# Altium schematic sheet IMX8_LPDDR4.SchDoc
size 594 x 420 mm; SheetNumber: 8; SheetTotal: 20
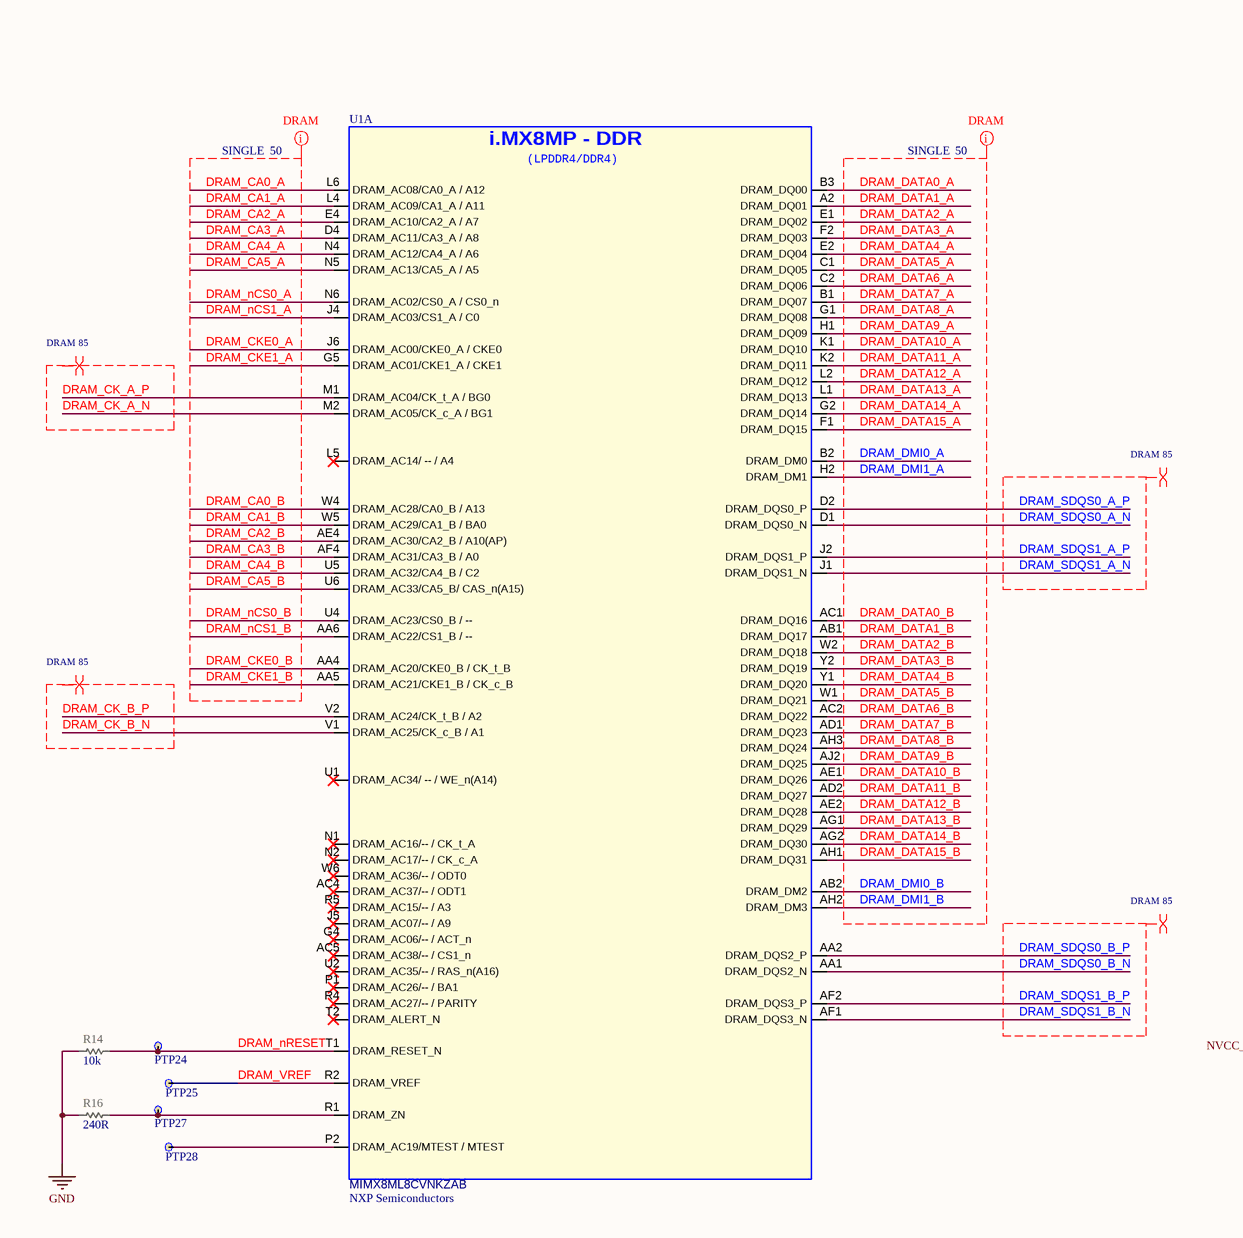
[diagram p0: IMX8_LPDDR4.SchDoc, top left]
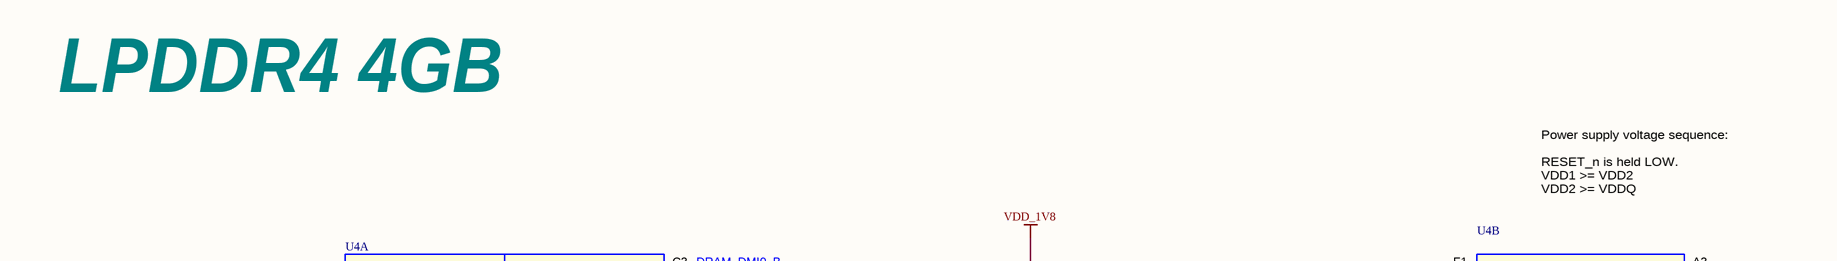
[diagram p1: IMX8_LPDDR4.SchDoc, top right]
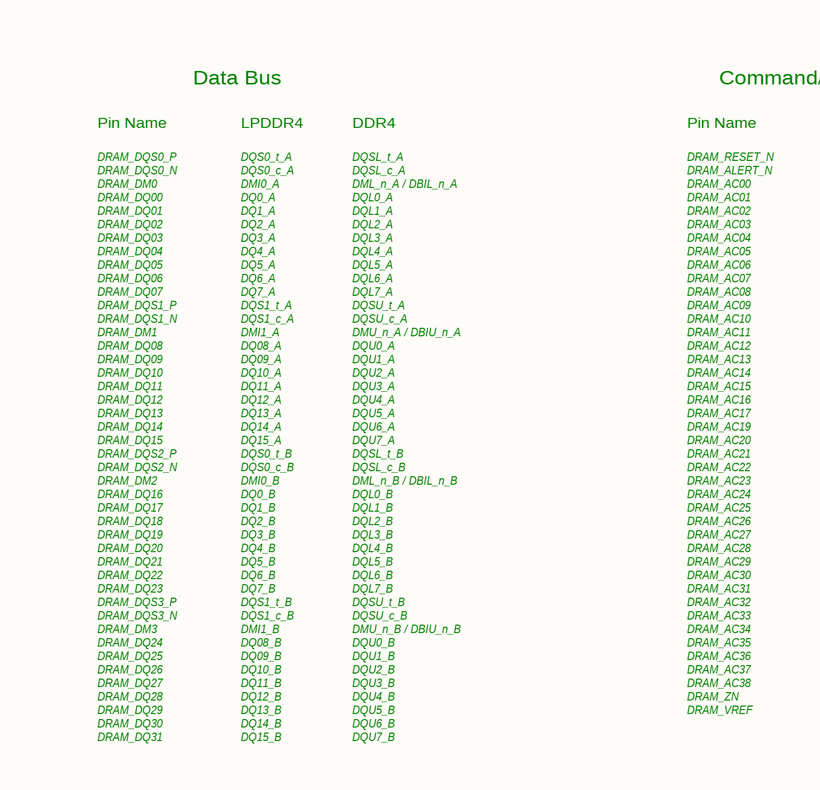
[diagram p2: IMX8_LPDDR4.SchDoc, bottom left]
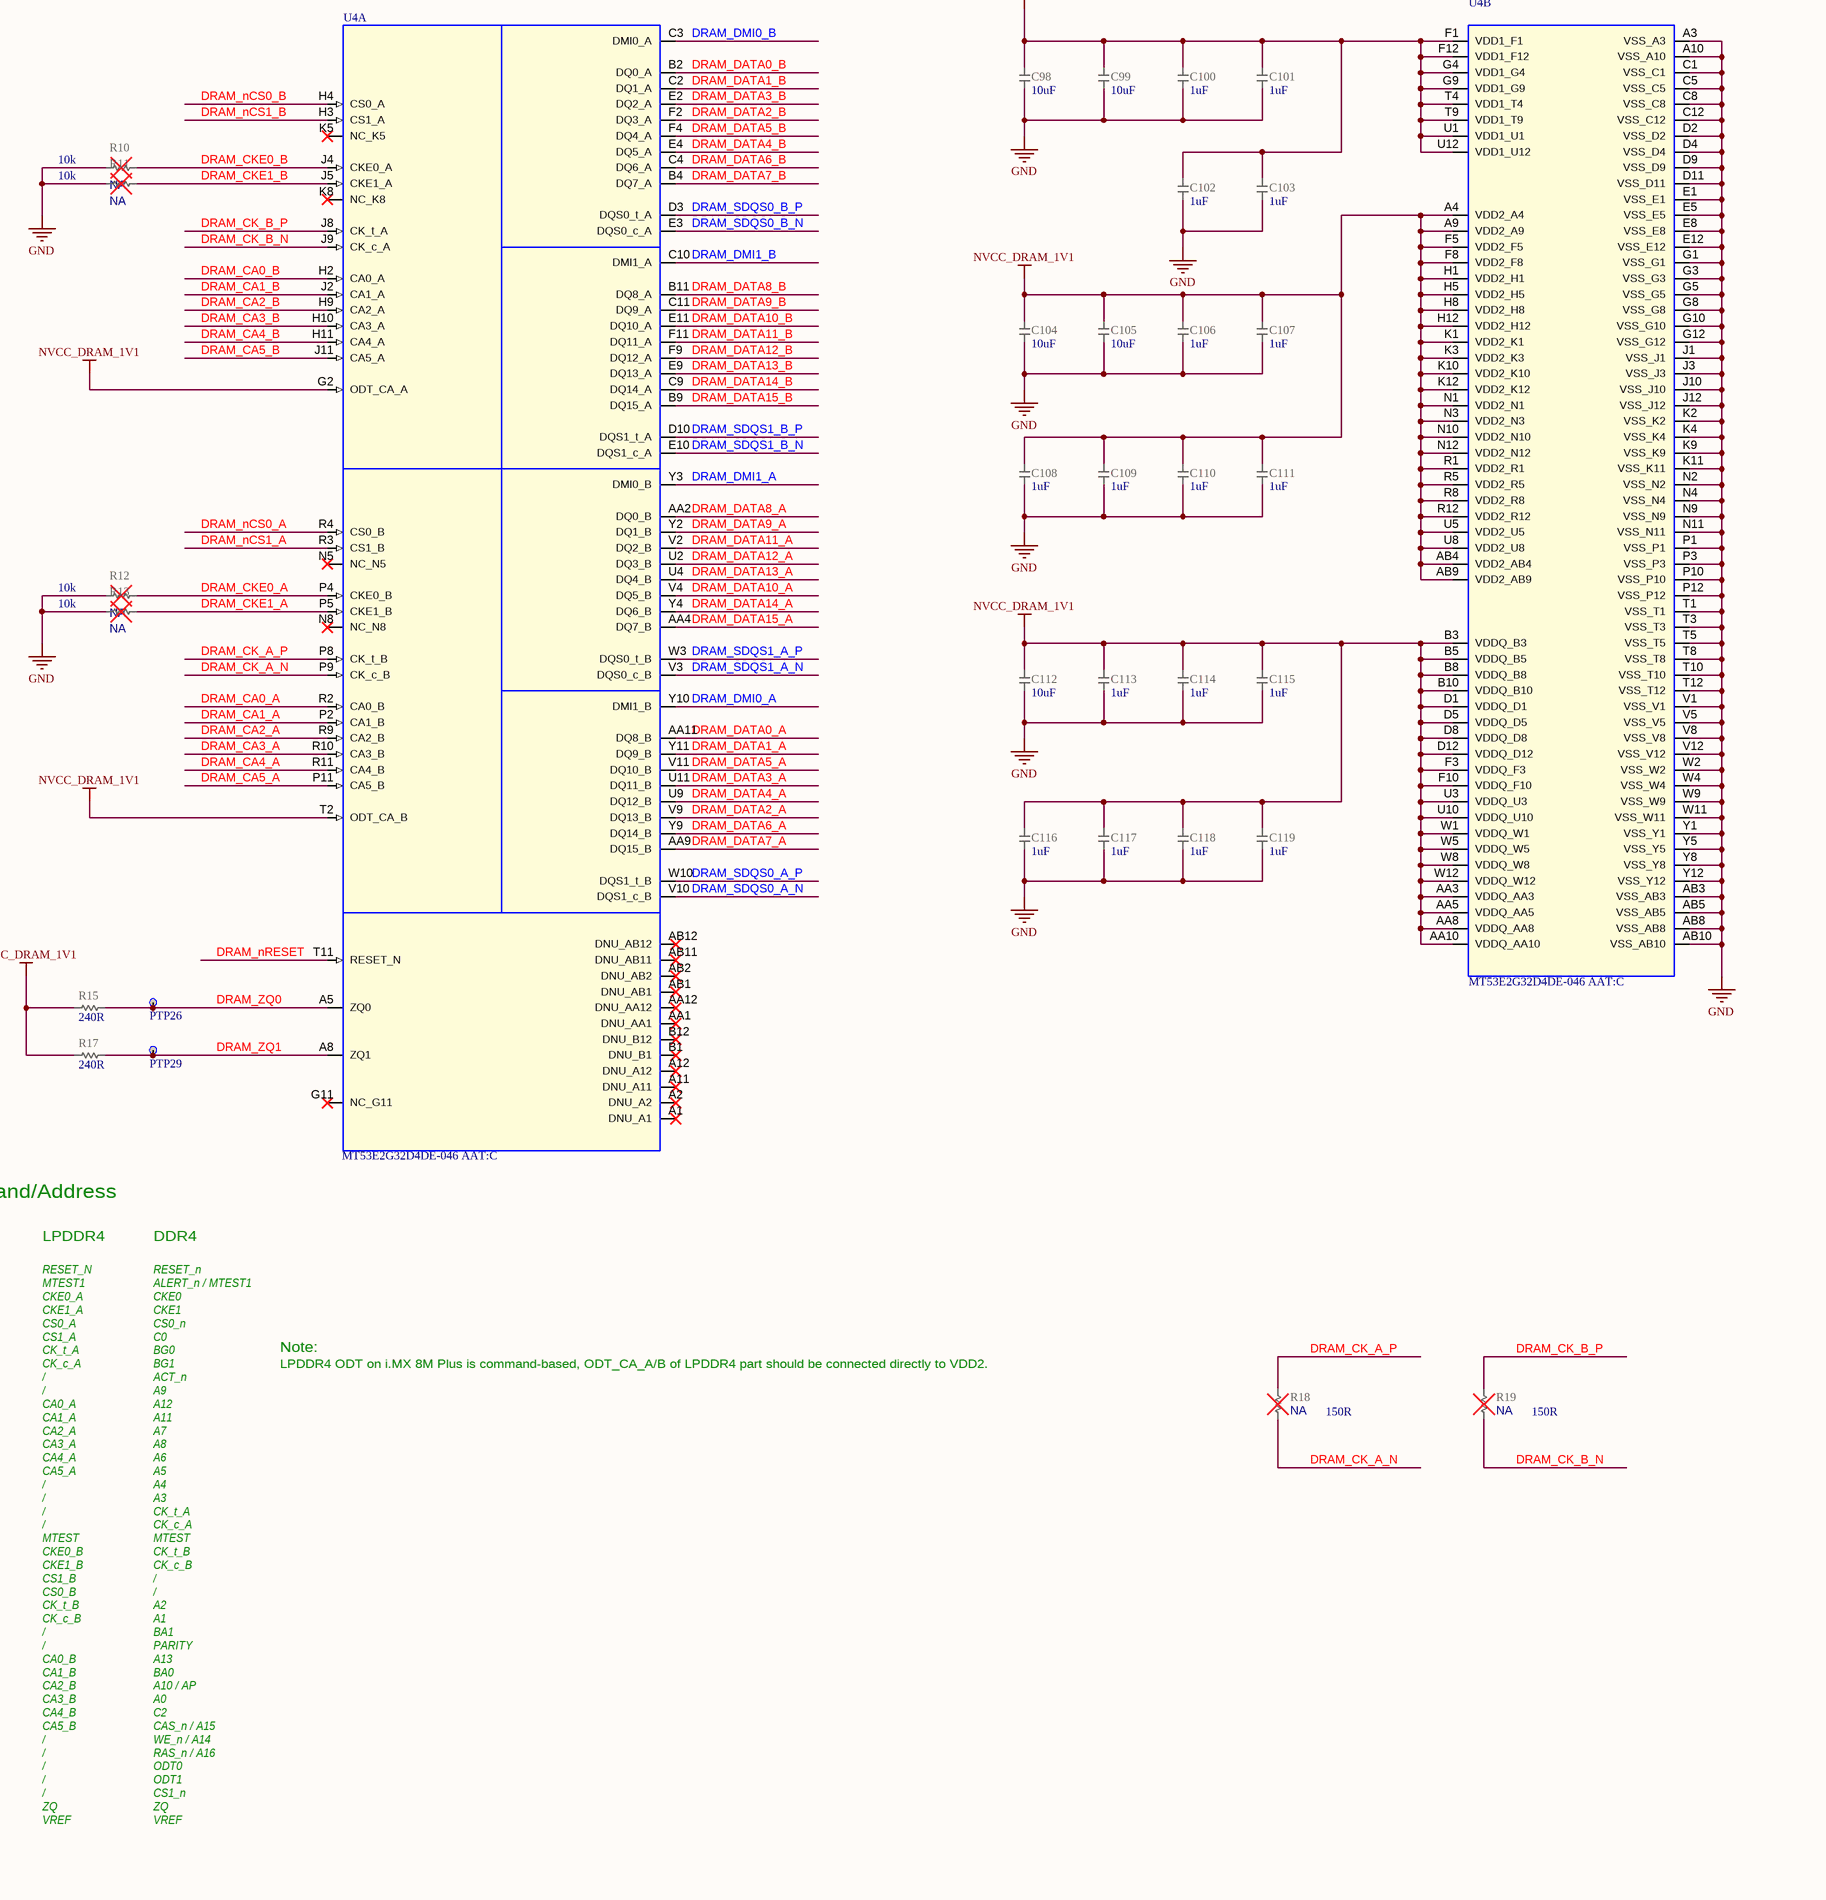
[diagram p3: IMX8_LPDDR4.SchDoc, bottom right]

## Parts
C98  value 10uF  [CAP_0402_H09W07_UN1Q]  (hidden comment: CAP_0402_10u_X6S)
C99  value 10uF  [CAP_0402_H09W07_UN1Q]  (hidden comment: CAP_0402_10u_X6S)
C100  value 1uF  [CAP_0201_UN1Q]  (hidden comment: CAP_0201_1uF_X6S)
C101  value 1uF  [CAP_0201_UN1Q]  (hidden comment: CAP_0201_1uF_X6S)
C102  value 1uF  [CAP_0201_UN1Q]  (hidden comment: CAP_0201_1uF_X6S)
C103  value 1uF  [CAP_0201_UN1Q]  (hidden comment: CAP_0201_1uF_X6S)
C104  value 10uF  [CAP_0402_H09W07_UN1Q]  (hidden comment: CAP_0402_10u_X6S)
C105  value 10uF  [CAP_0402_H09W07_UN1Q]  (hidden comment: CAP_0402_10u_X6S)
C106  value 1uF  [CAP_0201_UN1Q]  (hidden comment: CAP_0201_1uF_X6S)
C107  value 1uF  [CAP_0201_UN1Q]  (hidden comment: CAP_0201_1uF_X6S)
C108  value 1uF  [CAP_0201_UN1Q]  (hidden comment: CAP_0201_1uF_X6S)
C109  value 1uF  [CAP_0201_UN1Q]  (hidden comment: CAP_0201_1uF_X6S)
C110  value 1uF  [CAP_0201_UN1Q]  (hidden comment: CAP_0201_1uF_X6S)
C111  value 1uF  [CAP_0201_UN1Q]  (hidden comment: CAP_0201_1uF_X6S)
C112  value 10uF  [CAP_0402_H09W07_UN1Q]  (hidden comment: CAP_0402_10u_X6S)
C113  value 1uF  [CAP_0201_UN1Q]  (hidden comment: CAP_0201_1uF_X6S)
C114  value 1uF  [CAP_0201_UN1Q]  (hidden comment: CAP_0201_1uF_X6S)
C115  value 1uF  [CAP_0201_UN1Q]  (hidden comment: CAP_0201_1uF_X6S)
C116  value 1uF  [CAP_0201_UN1Q]  (hidden comment: CAP_0201_1uF_X6S)
C117  value 1uF  [CAP_0201_UN1Q]  (hidden comment: CAP_0201_1uF_X6S)
C118  value 1uF  [CAP_0201_UN1Q]  (hidden comment: CAP_0201_1uF_X6S)
C119  value 1uF  [CAP_0201_UN1Q]  (hidden comment: CAP_0201_1uF_X6S)
PTP24  PTP_0.4mm  [PTP_0.4mm]  (value not drawn)  (no BOM)
PTP25  PTP_0.4mm  [PTP_0.4mm]  (value not drawn)  (no BOM)
PTP26  PTP_0.4mm  [PTP_0.4mm]  (value not drawn)  (no BOM)
PTP27  PTP_0.4mm  [PTP_0.4mm]  (value not drawn)  (no BOM)
PTP28  PTP_0.4mm  [PTP_0.4mm]  (value not drawn)  (no BOM)
PTP29  PTP_0.4mm  [PTP_0.4mm]  (value not drawn)  (no BOM)
R10  value NA  [RES_0201_UN1Q]  (hidden comment: RES_0201_NA)
R11  value NA  [RES_0201_UN1Q]  (hidden comment: RES_0201_NA)
R12  value NA  [RES_0201_UN1Q]  (hidden comment: RES_0201_NA)
R13  value NA  [RES_0201_UN1Q]  (hidden comment: RES_0201_NA)
R14  value 10k  [RES_0201_UN1Q]  (hidden comment: RES_0201_10k)
R15  value 240R  [RES_0201_UN1Q]  (hidden comment: RES_0201_240R)
R16  value 240R  [RES_0201_UN1Q]  (hidden comment: RES_0201_240R)
R17  value 240R  [RES_0201_UN1Q]  (hidden comment: RES_0201_240R)
R18  value NA  [RES_0201_UN1Q]  (hidden comment: RES_0201_NA)
R19  value NA  [RES_0201_UN1Q]  (hidden comment: RES_0201_NA)
U1  Manufacturer: NXP Semiconductors  [BGA548C50P29X29_1500X1500X148]  (hidden comment: MIMX8ML8CVNKZAB)  (part A of 15)
U4  MT53E2G32D4DE-046 AAT:C  [BGA200C65P12X22_1000X1450X114]  (parts A,B of 2)

## Nets
GND: C98.2 C99.2 C100.2 C101.2 C102.2 C103.2 C104.2 C105.2 C106.2 C107.2 C108.2 C109.2 C110.2 C111.2 C112.2 C113.2 C114.2 C115.2 C116.2 C117.2 C118.2 C119.2 R10.1 R11.1 R12.1 R13.1 R14.1 R16.1 U4.A3(VSS_A3) U4.A10(VSS_A10) U4.AB3(VSS_AB3) U4.AB5(VSS_AB5) U4.AB8(VSS_AB8) U4.AB10(VSS_AB10) U4.C1(VSS_C1) U4.C5(VSS_C5) U4.C8(VSS_C8) U4.C12(VSS_C12) U4.D2(VSS_D2) U4.D4(VSS_D4) U4.D9(VSS_D9) U4.D11(VSS_D11) U4.E1(VSS_E1) U4.E5(VSS_E5) U4.E8(VSS_E8) U4.E12(VSS_E12) U4.G1(VSS_G1) U4.G3(VSS_G3) U4.G5(VSS_G5) U4.G8(VSS_G8) U4.G10(VSS_G10) U4.G12(VSS_G12) U4.J1(VSS_J1) U4.J3(VSS_J3) U4.J10(VSS_J10) U4.J12(VSS_J12) U4.K2(VSS_K2) U4.K4(VSS_K4) U4.K9(VSS_K9) U4.K11(VSS_K11) U4.N2(VSS_N2) U4.N4(VSS_N4) U4.N9(VSS_N9) U4.N11(VSS_N11) U4.P1(VSS_P1) U4.P3(VSS_P3) U4.P10(VSS_P10) U4.P12(VSS_P12) U4.T1(VSS_T1) U4.T3(VSS_T3) U4.T5(VSS_T5) U4.T8(VSS_T8) U4.T10(VSS_T10) U4.T12(VSS_T12) U4.V1(VSS_V1) U4.V5(VSS_V5) U4.V8(VSS_V8) U4.V12(VSS_V12) U4.W2(VSS_W2) U4.W4(VSS_W4) U4.W9(VSS_W9) U4.W11(VSS_W11) U4.Y1(VSS_Y1) U4.Y5(VSS_Y5) U4.Y8(VSS_Y8) U4.Y12(VSS_Y12)
NVCC_DRAM_1V1: C104.1 C105.1 C106.1 C107.1 C108.1 C109.1 C110.1 C111.1 C112.1 C113.1 C114.1 C115.1 C116.1 C117.1 C118.1 C119.1 R15.1 R17.1 U4.A4(VDD2_A4) U4.A9(VDD2_A9) U4.AA3(VDDQ_AA3) U4.AA5(VDDQ_AA5) U4.AA8(VDDQ_AA8) U4.AA10(VDDQ_AA10) U4.AB4(VDD2_AB4) U4.AB9(VDD2_AB9) U4.B3(VDDQ_B3) U4.B5(VDDQ_B5) U4.B8(VDDQ_B8) U4.B10(VDDQ_B10) U4.D1(VDDQ_D1) U4.D5(VDDQ_D5) U4.D8(VDDQ_D8) U4.D12(VDDQ_D12) U4.F3(VDDQ_F3) U4.F5(VDD2_F5) U4.F8(VDD2_F8) U4.F10(VDDQ_F10) U4.G2(ODT_CA_A) U4.H1(VDD2_H1) U4.H5(VDD2_H5) U4.H8(VDD2_H8) U4.H12(VDD2_H12) U4.K1(VDD2_K1) U4.K3(VDD2_K3) U4.K10(VDD2_K10) U4.K12(VDD2_K12) U4.N1(VDD2_N1) U4.N3(VDD2_N3) U4.N10(VDD2_N10) U4.N12(VDD2_N12) U4.R1(VDD2_R1) U4.R5(VDD2_R5) U4.R8(VDD2_R8) U4.R12(VDD2_R12) U4.T2(ODT_CA_B) U4.U3(VDDQ_U3) U4.U5(VDD2_U5) U4.U8(VDD2_U8) U4.U10(VDDQ_U10) U4.W1(VDDQ_W1) U4.W5(VDDQ_W5) U4.W8(VDDQ_W8) U4.W12(VDDQ_W12)
VDD_1V8: C98.1 C99.1 C100.1 C101.1 C102.1 C103.1 U4.F1(VDD1_F1) U4.F12(VDD1_F12) U4.G4(VDD1_G4) U4.G9(VDD1_G9) U4.T4(VDD1_T4) U4.T9(VDD1_T9) U4.U1(VDD1_U1) U4.U12(VDD1_U12)
DRAM_CA0_A: U1.L6(DRAM_AC08/CA0_A_/_A12) U4.R2(CA0_B)
DRAM_CA0_B: U1.W4(DRAM_AC28/CA0_B_/_A13) U4.H2(CA0_A)
DRAM_CA1_A: U1.L4(DRAM_AC09/CA1_A_/_A11) U4.P2(CA1_B)
DRAM_CA1_B: U1.W5(DRAM_AC29/CA1_B_/_BA0) U4.J2(CA1_A)
DRAM_CA2_A: U1.E4(DRAM_AC10/CA2_A_/_A7) U4.R9(CA2_B)
DRAM_CA2_B: U1.AE4(DRAM_AC30/CA2_B_/_A10(AP)) U4.H9(CA2_A)
DRAM_CA3_A: U1.D4(DRAM_AC11/CA3_A_/_A8) U4.R10(CA3_B)
DRAM_CA3_B: U1.AF4(DRAM_AC31/CA3_B_/_A0) U4.H10(CA3_A)
DRAM_CA4_A: U1.N4(DRAM_AC12/CA4_A_/_A6) U4.R11(CA4_B)
DRAM_CA4_B: U1.U5(DRAM_AC32/CA4_B_/_C2) U4.H11(CA4_A)
DRAM_CA5_A: U1.N5(DRAM_AC13/CA5_A_/_A5) U4.P11(CA5_B)
DRAM_CA5_B: U1.U6(DRAM_AC33/CA5_B/_CAS_n(A15)) U4.J11(CA5_A)
DRAM_CK_A_N: R18.1 U1.M2(DRAM_AC05/CK_c_A_/_BG1) U4.P9(CK_c_B)
DRAM_CK_A_P: R18.2 U1.M1(DRAM_AC04/CK_t_A_/_BG0) U4.P8(CK_t_B)
DRAM_CK_B_N: R19.1 U1.V1(DRAM_AC25/CK_c_B_/_A1) U4.J9(CK_c_A)
DRAM_CK_B_P: R19.2 U1.V2(DRAM_AC24/CK_t_B_/_A2) U4.J8(CK_t_A)
DRAM_CKE0_A: R12.2 U1.J6(DRAM_AC00/CKE0_A_/_CKE0) U4.P4(CKE0_B)
DRAM_CKE0_B: R10.2 U1.AA4(DRAM_AC20/CKE0_B_/_CK_t_B) U4.J4(CKE0_A)
DRAM_CKE1_A: R13.2 U1.G5(DRAM_AC01/CKE1_A_/_CKE1) U4.P5(CKE1_B)
DRAM_CKE1_B: R11.2 U1.AA5(DRAM_AC21/CKE1_B_/_CK_c_B) U4.J5(CKE1_A)
DRAM_DATA0_A: U1.B3(DRAM_DQ00) U4.AA11(DQ8_B)
DRAM_DATA0_B: U1.AC1(DRAM_DQ16) U4.B2(DQ0_A)
DRAM_DATA1_A: U1.A2(DRAM_DQ01) U4.Y11(DQ9_B)
DRAM_DATA1_B: U1.AB1(DRAM_DQ17) U4.C2(DQ1_A)
DRAM_DATA2_A: U1.E1(DRAM_DQ02) U4.V9(DQ13_B)
DRAM_DATA2_B: U1.W2(DRAM_DQ18) U4.F2(DQ3_A)
DRAM_DATA3_A: U1.F2(DRAM_DQ03) U4.U11(DQ11_B)
DRAM_DATA3_B: U1.Y2(DRAM_DQ19) U4.E2(DQ2_A)
DRAM_DATA4_A: U1.E2(DRAM_DQ04) U4.U9(DQ12_B)
DRAM_DATA4_B: U1.Y1(DRAM_DQ20) U4.E4(DQ5_A)
DRAM_DATA5_A: U1.C1(DRAM_DQ05) U4.V11(DQ10_B)
DRAM_DATA5_B: U1.W1(DRAM_DQ21) U4.F4(DQ4_A)
DRAM_DATA6_A: U1.C2(DRAM_DQ06) U4.Y9(DQ14_B)
DRAM_DATA6_B: U1.AC2(DRAM_DQ22) U4.C4(DQ6_A)
DRAM_DATA7_A: U1.B1(DRAM_DQ07) U4.AA9(DQ15_B)
DRAM_DATA7_B: U1.AD1(DRAM_DQ23) U4.B4(DQ7_A)
DRAM_DATA8_A: U1.G1(DRAM_DQ08) U4.AA2(DQ0_B)
DRAM_DATA8_B: U1.AH3(DRAM_DQ24) U4.B11(DQ8_A)
DRAM_DATA9_A: U1.H1(DRAM_DQ09) U4.Y2(DQ1_B)
DRAM_DATA9_B: U1.AJ2(DRAM_DQ25) U4.C11(DQ9_A)
DRAM_DATA10_A: U1.K1(DRAM_DQ10) U4.V4(DQ5_B)
DRAM_DATA10_B: U1.AE1(DRAM_DQ26) U4.E11(DQ10_A)
DRAM_DATA11_A: U1.K2(DRAM_DQ11) U4.V2(DQ2_B)
DRAM_DATA11_B: U1.AD2(DRAM_DQ27) U4.F11(DQ11_A)
DRAM_DATA12_A: U1.L2(DRAM_DQ12) U4.U2(DQ3_B)
DRAM_DATA12_B: U1.AE2(DRAM_DQ28) U4.F9(DQ12_A)
DRAM_DATA13_A: U1.L1(DRAM_DQ13) U4.U4(DQ4_B)
DRAM_DATA13_B: U1.AG1(DRAM_DQ29) U4.E9(DQ13_A)
DRAM_DATA14_A: U1.G2(DRAM_DQ14) U4.Y4(DQ6_B)
DRAM_DATA14_B: U1.AG2(DRAM_DQ30) U4.C9(DQ14_A)
DRAM_DATA15_A: U1.F1(DRAM_DQ15) U4.AA4(DQ7_B)
DRAM_DATA15_B: U1.AH1(DRAM_DQ31) U4.B9(DQ15_A)
DRAM_DMI0_A: U1.B2(DRAM_DM0) U4.Y10(DMI1_B)
DRAM_DMI0_B: U1.AB2(DRAM_DM2) U4.C3(DMI0_A)
DRAM_DMI1_A: U1.H2(DRAM_DM1) U4.Y3(DMI0_B)
DRAM_DMI1_B: U1.AH2(DRAM_DM3) U4.C10(DMI1_A)
DRAM_nCS0_A: U1.N6(DRAM_AC02/CS0_A_/_CS0_n) U4.R4(CS0_B)
DRAM_nCS0_B: U1.U4(DRAM_AC23/CS0_B_/_--) U4.H4(CS0_A)
DRAM_nCS1_A: U1.J4(DRAM_AC03/CS1_A_/_C0) U4.R3(CS1_B)
DRAM_nCS1_B: U1.AA6(DRAM_AC22/CS1_B_/_--) U4.H3(CS1_A)
DRAM_nRESET: PTP24.1(TP) R14.2 U1.T1(DRAM_RESET_N) U4.T11(RESET_N)
DRAM_SDQS0_A_N: U1.D1(DRAM_DQS0_N) U4.V10(DQS1_c_B)
DRAM_SDQS0_A_P: U1.D2(DRAM_DQS0_P) U4.W10(DQS1_t_B)
DRAM_SDQS0_B_N: U1.AA1(DRAM_DQS2_N) U4.E3(DQS0_c_A)
DRAM_SDQS0_B_P: U1.AA2(DRAM_DQS2_P) U4.D3(DQS0_t_A)
DRAM_SDQS1_A_N: U1.J1(DRAM_DQS1_N) U4.V3(DQS0_c_B)
DRAM_SDQS1_A_P: U1.J2(DRAM_DQS1_P) U4.W3(DQS0_t_B)
DRAM_SDQS1_B_N: U1.AF1(DRAM_DQS3_N) U4.E10(DQS1_c_A)
DRAM_SDQS1_B_P: U1.AF2(DRAM_DQS3_P) U4.D10(DQS1_t_A)
DRAM_VREF: PTP25.1(TP) U1.R2(DRAM_VREF)
DRAM_ZQ0: PTP26.1(TP) R15.2 U4.A5(ZQ0)
DRAM_ZQ1: PTP29.1(TP) R17.2 U4.A8(ZQ1)
NetPTP27_1: PTP27.1(TP) R16.2 U1.R1(DRAM_ZN)
NetPTP28_1: PTP28.1(TP) U1.P2(DRAM_AC19/MTEST_/_MTEST)

Not connected (* = marked no-connect by the designer): U1 AC4(DRAM_AC37/--_/_ODT1)* AC5(DRAM_AC38/--_/_CS1_n)* G4(DRAM_AC06/--_/_ACT_n)* J5(DRAM_AC07/--_/_A9)* L5(DRAM_AC14/_--_/_A4)* N1(DRAM_AC16/--_/_CK_t_A)* N2(DRAM_AC17/--_/_CK_c_A)* P1(DRAM_AC26/--_/_BA1)* R4(DRAM_AC27/--_/_PARITY)* R5(DRAM_AC15/--_/_A3)* T2(DRAM_ALERT_N)* U1(DRAM_AC34/_--_/_WE_n(A14))* U2(DRAM_AC35/--_/_RAS_n(A16))* W6(DRAM_AC36/--_/_ODT0)*; U4 A1(DNU_A1)* A2(DNU_A2)* A11(DNU_A11)* A12(DNU_A12)* AA1(DNU_AA1)* AA12(DNU_AA12)* AB1(DNU_AB1)* AB2(DNU_AB2)* AB11(DNU_AB11)* AB12(DNU_AB12)* B1(DNU_B1)* B12(DNU_B12)* G11(NC_G11)* K5(NC_K5)* K8(NC_K8)* N5(NC_N5)* N8(NC_N8)*

## Layout directives
differential pair; differential pair class 85; net class DRAM: DRAM_CK_A_N, DRAM_CK_A_P, DRAM_CK_B_N, DRAM_CK_B_P, DRAM_SDQS0_A_N, DRAM_SDQS0_A_P, DRAM_SDQS0_B_N, DRAM_SDQS0_B_P, DRAM_SDQS1_A_N, DRAM_SDQS1_A_P, DRAM_SDQS1_B_N, DRAM_SDQS1_B_P
net class SINGLE; Single impedance: 50: DRAM_CA0_A, DRAM_CA0_B, DRAM_CA1_A, DRAM_CA1_B, DRAM_CA2_A, DRAM_CA2_B, DRAM_CA3_A, DRAM_CA3_B, DRAM_CA4_A, DRAM_CA4_B, DRAM_CA5_A, DRAM_CA5_B, DRAM_CKE0_A, DRAM_CKE0_B, DRAM_CKE1_A, DRAM_CKE1_B, DRAM_DATA0_A, DRAM_DATA0_B, DRAM_DATA1_A, DRAM_DATA1_B, DRAM_DATA2_A, DRAM_DATA2_B, DRAM_DATA3_A, DRAM_DATA3_B, DRAM_DATA4_A, DRAM_DATA4_B, DRAM_DATA5_A, DRAM_DATA5_B, DRAM_DATA6_A, DRAM_DATA6_B, DRAM_DATA7_A, DRAM_DATA7_B, DRAM_DATA8_A, DRAM_DATA8_B, DRAM_DATA9_A, DRAM_DATA9_B, DRAM_DATA10_A, DRAM_DATA10_B, DRAM_DATA11_A, DRAM_DATA11_B, DRAM_DATA12_A, DRAM_DATA12_B, DRAM_DATA13_A, DRAM_DATA13_B, DRAM_DATA14_A, DRAM_DATA14_B, DRAM_DATA15_A, DRAM_DATA15_B, DRAM_DMI0_A, DRAM_DMI0_B, DRAM_DMI1_A, DRAM_DMI1_B, DRAM_nCS0_A, DRAM_nCS0_B, DRAM_nCS1_A, DRAM_nCS1_B

## Notes on the sheet
- LPDDR4 4GB
- Power supply voltage sequence:
  RESET_n is held LOW.
  VDD1 >= VDD2
  VDD2 >= VDDQ
- 10k
- Data Bus
- Command/Address
- Pin Name
- LPDDR4
- DDR4
- Note:
- LPDDR4 ODT on i.MX 8M Plus is command-based, ODT_CA_A/B of LPDDR4 part should be connected directly to VDD2.
- (near R18) 150R
- (near R19) 150R
- DRAM_DQS0_P
  DRAM_DQS0_N
  DRAM_DM0
  DRAM_DQ00
  DRAM_DQ01
  DRAM_DQ02
  DRAM_DQ03
  DRAM_DQ04
  DRAM_DQ05
  DRAM_DQ06
  DRAM_DQ07
  DRAM_DQS1_P
  DRAM_DQS1_N
  DRAM_DM1
  DRAM_DQ08
  DRAM_DQ09
  DRAM_DQ10
  DRAM_DQ11
  DRAM_DQ12
  DRAM_DQ13
  DRAM_DQ14
  DRAM_DQ15
  DRAM_DQS2_P
  DRAM_DQS2_N
  DRAM_DM2
  DRAM_DQ16
  DRAM_DQ17
  DRAM_DQ18
  DRAM_DQ19
  DRAM_DQ20
  DRAM_DQ21
  DRAM_DQ22
  DRAM_DQ23
  DRAM_DQS3_P
  DRAM_DQS3_N
  DRAM_DM3
  DRAM_DQ24
  DRAM_DQ25
  DRAM_DQ26
  DRAM_DQ27
  DRAM_DQ28
  DRAM_DQ29
  DRAM_DQ30
  DRAM_DQ31
- DQS0_t_A
  DQS0_c_A
  DMI0_A
  DQ0_A
  DQ1_A
  DQ2_A
  DQ3_A
  DQ4_A
  DQ5_A
  DQ6_A
  DQ7_A
  DQS1_t_A
  DQS1_c_A
  DMI1_A
  DQ08_A
  DQ09_A
  DQ10_A
  DQ11_A
  DQ12_A
  DQ13_A
  DQ14_A
  DQ15_A
  DQS0_t_B
  DQS0_c_B
  DMI0_B
  DQ0_B
  DQ1_B
  DQ2_B
  DQ3_B
  DQ4_B
  DQ5_B
  DQ6_B
  DQ7_B
  DQS1_t_B
  DQS1_c_B
  DMI1_B
  DQ08_B
  DQ09_B
  DQ10_B
  DQ11_B
  DQ12_B
  DQ13_B
  DQ14_B
  DQ15_B
- DQSL_t_A
  DQSL_c_A
  DML_n_A / DBIL_n_A
  DQL0_A
  DQL1_A
  DQL2_A
  DQL3_A
  DQL4_A
  DQL5_A
  DQL6_A
  DQL7_A
  DQSU_t_A
  DQSU_c_A
  DMU_n_A / DBIU_n_A
  DQU0_A
  DQU1_A
  DQU2_A
  DQU3_A
  DQU4_A
  DQU5_A
  DQU6_A
  DQU7_A
  DQSL_t_B
  DQSL_c_B
  DML_n_B / DBIL_n_B
  DQL0_B
  DQL1_B
  DQL2_B
  DQL3_B
  DQL4_B
  DQL5_B
  DQL6_B
  DQL7_B
  DQSU_t_B
  DQSU_c_B
  DMU_n_B / DBIU_n_B
  DQU0_B
  DQU1_B
  DQU2_B
  DQU3_B
  DQU4_B
  DQU5_B
  DQU6_B
  DQU7_B
- DRAM_RESET_N
  DRAM_ALERT_N
  DRAM_AC00
  DRAM_AC01
  DRAM_AC02
  DRAM_AC03
  DRAM_AC04
  DRAM_AC05
  DRAM_AC06
  DRAM_AC07
  DRAM_AC08
  DRAM_AC09
  DRAM_AC10
  DRAM_AC11
  DRAM_AC12
  DRAM_AC13
  DRAM_AC14
  DRAM_AC15
  DRAM_AC16
  DRAM_AC17
  DRAM_AC19
  DRAM_AC20
  DRAM_AC21
  DRAM_AC22
  DRAM_AC23
  DRAM_AC24
  DRAM_AC25
  DRAM_AC26
  DRAM_AC27
  DRAM_AC28
  DRAM_AC29
  DRAM_AC30
  DRAM_AC31
  DRAM_AC32
  DRAM_AC33
  DRAM_AC34
  DRAM_AC35
  DRAM_AC36
  DRAM_AC37
  DRAM_AC38
  DRAM_ZN
  DRAM_VREF
- RESET_N
  MTEST1
  CKE0_A
  CKE1_A
  CS0_A
  CS1_A
  CK_t_A
  CK_c_A
  /
  /
  CA0_A
  CA1_A
  CA2_A
  CA3_A
  CA4_A
  CA5_A
  /
  /
  /
  /
  MTEST
  CKE0_B
  CKE1_B
  CS1_B
  CS0_B
  CK_t_B
  CK_c_B
  /
  /
  CA0_B
  CA1_B
  CA2_B
  CA3_B
  CA4_B
  CA5_B
  /
  /
  /
  /
  /
  ZQ
  VREF
- RESET_n
  ALERT_n / MTEST1
  CKE0
  CKE1
  CS0_n
  C0
  BG0
  BG1
  ACT_n
  A9
  A12
  A11
  A7
  A8
  A6
  A5
  A4
  A3
  CK_t_A
  CK_c_A
  MTEST
  CK_t_B
  CK_c_B
  /
  /
  A2
  A1
  BA1
  PARITY
  A13
  BA0
  A10 / AP
  A0
  C2
  CAS_n / A15
  WE_n / A14
  RAS_n / A16
  ODT0
  ODT1
  CS1_n
  ZQ
  VREF
- DWG NO:
- REV:
- THIS DOCUMENT AND THE DATA DISCLOSED HEREIN OR
- HEREWITH IS THE PROPERTY OF ALTIUM LIMITED AND MAY
- BE FREELY DISTRIBUTED IN WHOLE. NO RIGHTS ARE
- RESERVED OR EXPRESS OR IMPLIED WARANTEE GIVEN.
- REVISION
- DESCRIPTION
- DATE
- APPROVED
- ENG:
- APPROVALS
- PROJECT
- DSN:
- CHK:
- REFERENCE DOCUMENTS
- PROJECT REVISION:
- TITLE
- DOCUMENT REVISION:
- DESIGN ITEM:
- BOM:
- FAB DWG:
- PCB DWG:
- ASSY DWG:
- SCALE:
- A2
- SIZE
- CAGE CODE
- FILE NAME
- DWG NO.
- SHEET
- OF
- REV
- (in symbol CMP-001-000983-8, part A) i.MX8MP - DDR; (LPDDR4/DDR4)

## Library data of the parts
C98 C99 C104 C105 C112 = CMP-001-000883-14: CAP; Part Number: GMC04X6S106M6R3NT; Manufacturer: Cal-Chip Electronics, Inc.; Manufacturer: Cal-Chip Electronics; Voltage: 6.3V; Tolerance: +/-20%; Temperature characteristics: X6S; Sort order: 304; HasBeenBuilt: TBD; Alternative component: Allowed; System: RLC; Package: 0402; ComponentLink1Description: 1_Datasheet; ComponentLink2Description: 2_Product page; ComponentLink3Description: 3_X-information; ComponentLink4Description: 4_X-information; Creation date: 26042024; Manufacturer Part Number: GMC04X6S106M6R3NT; Component Type: Capacitor
C100-C103 C106-C111 C113-C119 = CMP-001-000336-15: CAP; Part Number: KGM03CS61A105MH; Manufacturer: Kyocera; Manufacturer: Kyocera AVX; Temperature characteristics: X6S; Voltage: 10V; Tolerance: +/-20%; Sort order: 302; HasBeenBuilt: False; Alternative component: Allowed; System: RLC; Package: 0201; Operating temperature range: -55C to +105C; ClassName: SMALL; ComponentLink1Description: 1_Datasheet; ComponentLink2Description: 2_Product page; ComponentLink3Description: 3_X-information; ComponentLink4Description: 4_X-information; Creation date: 20190101; Source: RLC_UN1Q.SchLib; Manufacturer Part Number: KGM03CS61A105MH; Component Type: Capacitor
PTP24-PTP29 = CMP-001-001296-3: Production Testpoint 0.4mm. Flying probe. Use 1mm pitch.; Part Number: PTP 0.4mm; ComponentLink4Description: 4_X-information; ComponentLink1Description: 1_Datasheet; Sort order: -; ClassName: SMALL; System: Test Point; HasBeenBuilt: -; Design Item ID: PTP_0.4mm; ComponentLink3Description: 3_X-information; Creation date: 20240909; ComponentLink2Description: 2_Product page; Component Type: Test Point
R10-R13 R18 R19 = CMP-001-000434-10: Not Assembled - RES; Sort order: 999; HasBeenBuilt: TBD; System: RLC; Package: 0201; ClassName: SMALL; ComponentLink1Description: 1_Datasheet; ComponentLink2Description: 2_Product page; ComponentLink3Description: 3_X-information; ComponentLink4Description: 4_X-information; Creation date: 20190101; Source: RLC_UN1Q.SchLib; Component Type: Resistor
R14 = CMP-001-000446-13: RES; Part Number: RC0201FR-0710KL; Manufacturer: YAGEO; Power Rating: 1/20W; Sort order: 322; HasBeenBuilt: TBD; Tolerance: 1%; Alternative component: Allowed; System: RLC; Package: 0201; ClassName: SMALL; ComponentLink1Description: 1_Datasheet; ComponentLink2Description: 2_Product page; ComponentLink3Description: 3_X-information; ComponentLink4Description: 4_X-information; Creation date: 20190101; Source: RLC_UN1Q.SchLib; Component Type: Resistor
R15-R17 = CMP-001-000554-13: RES; Part Number: ERJ-1GEJ241C; Manufacturer: Panasonic Electronic Components; Tolerance: 1%; Power Rating: 1/20W; Sort order: 322; HasBeenBuilt: TBD; Alternative component: Allowed; System: RLC; Package: 0201; ClassName: SMALL; ComponentLink1Description: 1_Datasheet; ComponentLink2Description: 2_Product page; ComponentLink3Description: 3_X-information; ComponentLink4Description: 4_X-information; Creation date: 20190101; Source: RLC_UN1Q.SchLib; Component Type: Resistor
U1 = CMP-001-000983-8: CPU QUAD CORTEX A53+M4 1.6GHZ BGA548 Industrial; Sort order: 501; System: IC; ComponentLink1Description: 1_Datasheet; ComponentLink1URL: https://www.nxp.com/part/MIMX8ML8CVNKZAB#/; ComponentLink2Description: 2_Product page; ComponentLink3Description: 3_X-information; ComponentLink4Description: 4_X-information; Creation date: 20240524; Dimensions WxLxH: 15 x 15 x 1.33mm; Manufacturer: NXP SEMICONDUCTORS; Operating temperature range: -40... +105 °C; Package: FCBGA548; Part Number: MIMX8ML8CVNKZAB; ClassName: BIG; Source: UUDET_KOMPONENTIT.SchLib; Design Item ID: MIMX8ML8CVNKZAB; Manufacturer Part Number: MIMX8ML8CVNKZAB; Component Type: Processor
U4 = CMP-001-001446-1: MEM LPDDR4 SDRAM 2133MHz 2Gx32Gb 1.1V; Manufacturer: Micron; Sort order: 511; System: IC; ComponentLink1Description: 1_Datasheet; ComponentLink1URL: https://www.micron.com/products/memory/dram-components/lpddr4/part-catalog/part-detail/mt53e2g32d4de-046-aat-c#login-modal; ComponentLink2Description: 2_Product page; ComponentLink2URL: https://www.micron.com/products/memory/dram-components/lpddr4/part-catalog/part-detail/mt53e2g32d4de-046-aat-c; ComponentLink3Description: 3_X-information; ComponentLink4Description: 4_X-information; Creation Date: 20250619; Dimensions WxLxH: 10x14.5x1.2mm; Operating temperature range: -40 .... +105 °C; Package: TFBGA-200; ECCN: EAR99; ClassName: BIG; Design Item ID: MT53E2G32D4DE-046 AAT:C; Manufacturer Part Number: MT53E2G32D4DE-046 AAT:C; Component Type: Memory; Part Number: MT53E2G32D4DE-046 AAT:C